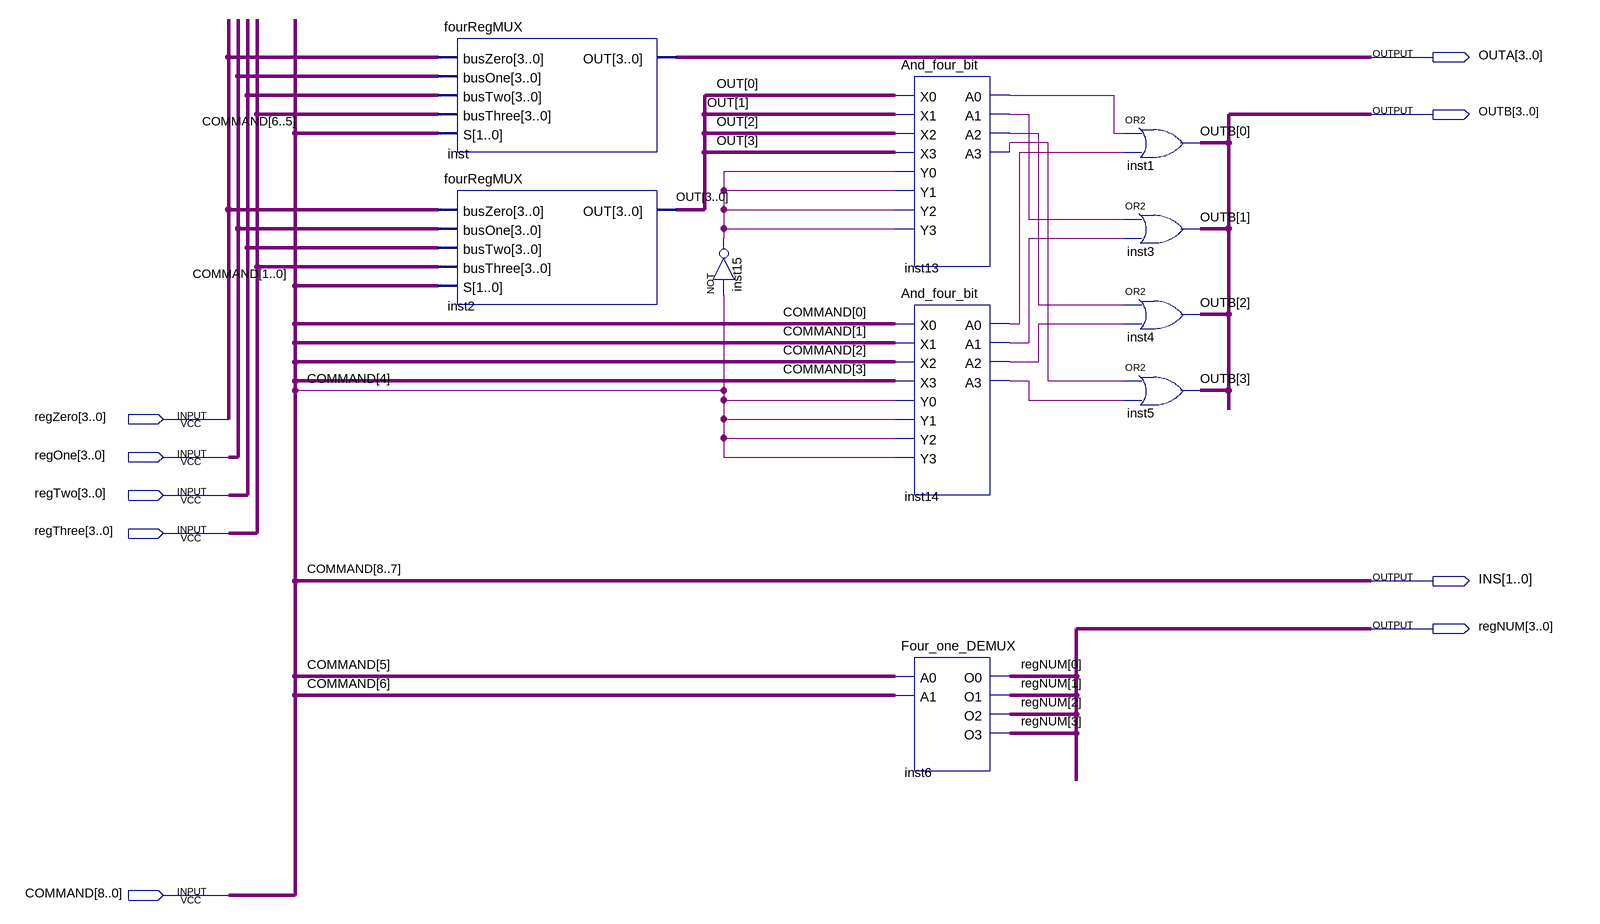
[diagram p0: schematic sheet]
// Quartus schematic DecodingCircuit.bdf as structural Verilog: 10 symbols, 9 pins
module DecodingCircuit (
  input  [3:0] regZero,
  input  [3:0] regOne,
  input  [3:0] regTwo,
  input  [3:0] regThree,
  input  [8:0] COMMAND,
  output [3:0] OUTA,
  output [3:0] OUTB,
  output [1:0] INS,
  output [3:0] regNUM
);

  wire inst13_a0, inst13_a1, inst13_a2, inst13_a3, inst14_a0, inst14_a1, inst14_a2, inst14_a3, inst15_out;
  wire [3:0] OUT;

  fourRegMUX inst (
    .busZero(regZero), .busOne(regOne), .busTwo(regTwo), .busThree(regThree), .S(COMMAND[6:5]), .OUT(OUTA));
  fourRegMUX inst2 (
    .busZero(regZero), .busOne(regOne), .busTwo(regTwo), .busThree(regThree), .S(COMMAND[1:0]), .OUT(OUT));
  not inst15 (inst15_out, COMMAND[4]);
  And_four_bit inst13 (
    .X0(OUT[0]), .X1(OUT[1]), .X2(OUT[2]), .X3(OUT[3]), .Y0(inst15_out), .Y1(inst15_out), .Y2(inst15_out),
    .Y3(inst15_out), .A0(inst13_a0), .A1(inst13_a1), .A2(inst13_a2), .A3(inst13_a3));
  And_four_bit inst14 (
    .X0(COMMAND[0]), .X1(COMMAND[1]), .X2(COMMAND[2]), .X3(COMMAND[3]), .Y0(COMMAND[4]), .Y1(COMMAND[4]),
    .Y2(COMMAND[4]), .Y3(COMMAND[4]), .A0(inst14_a0), .A1(inst14_a1), .A2(inst14_a2), .A3(inst14_a3));
  Four_one_DEMUX inst6 (
    .A0(COMMAND[5]), .A1(COMMAND[6]), .O0(regNUM[0]), .O1(regNUM[1]), .O2(regNUM[2]), .O3(regNUM[3]));
  or inst1 (OUTB[0], inst13_a0, inst14_a0);
  or inst3 (OUTB[1], inst13_a1, inst14_a1);
  or inst4 (OUTB[2], inst13_a2, inst14_a2);
  or inst5 (OUTB[3], inst13_a3, inst14_a3);

  assign INS = COMMAND[8:7];
endmodule
